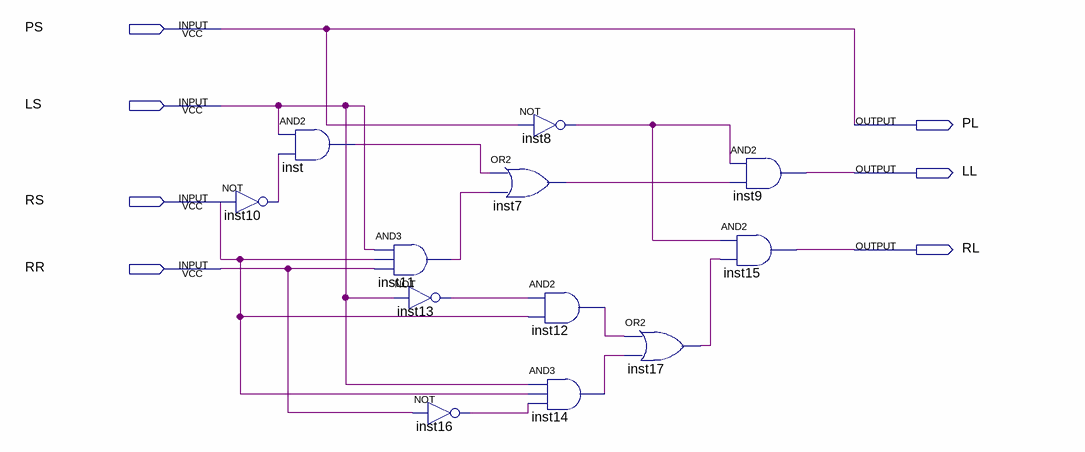
[diagram p0: schematic sheet]
// Quartus schematic NEW2.bdf as structural Verilog: 12 symbols, 7 pins
module NEW2 (
  input  PS,
  input  LS,
  input  RS,
  input  RR,
  output PL,
  output LL,
  output RL
);

  wire inst7_out, inst8_out, inst10_out, inst11_out, inst12_out, inst13_out, inst14_out, inst16_out,
       inst17_out, inst_out;

  not inst10 (inst10_out, RS);
  and inst (inst_out, LS, inst10_out);
  and inst11 (inst11_out, LS, RS, RR);
  not inst13 (inst13_out, LS);
  not inst16 (inst16_out, RR);
  not inst8 (inst8_out, PS);
  or inst7 (inst7_out, inst_out, inst11_out);
  and inst12 (inst12_out, inst13_out, RS);
  and inst14 (inst14_out, LS, RS, inst16_out);
  or inst17 (inst17_out, inst12_out, inst14_out);
  and inst9 (LL, inst8_out, inst7_out);
  and inst15 (RL, inst8_out, inst17_out);

  assign PL = PS;
endmodule
